# EAGLE design jayday_fez40_5v (EAGLE 6.3)
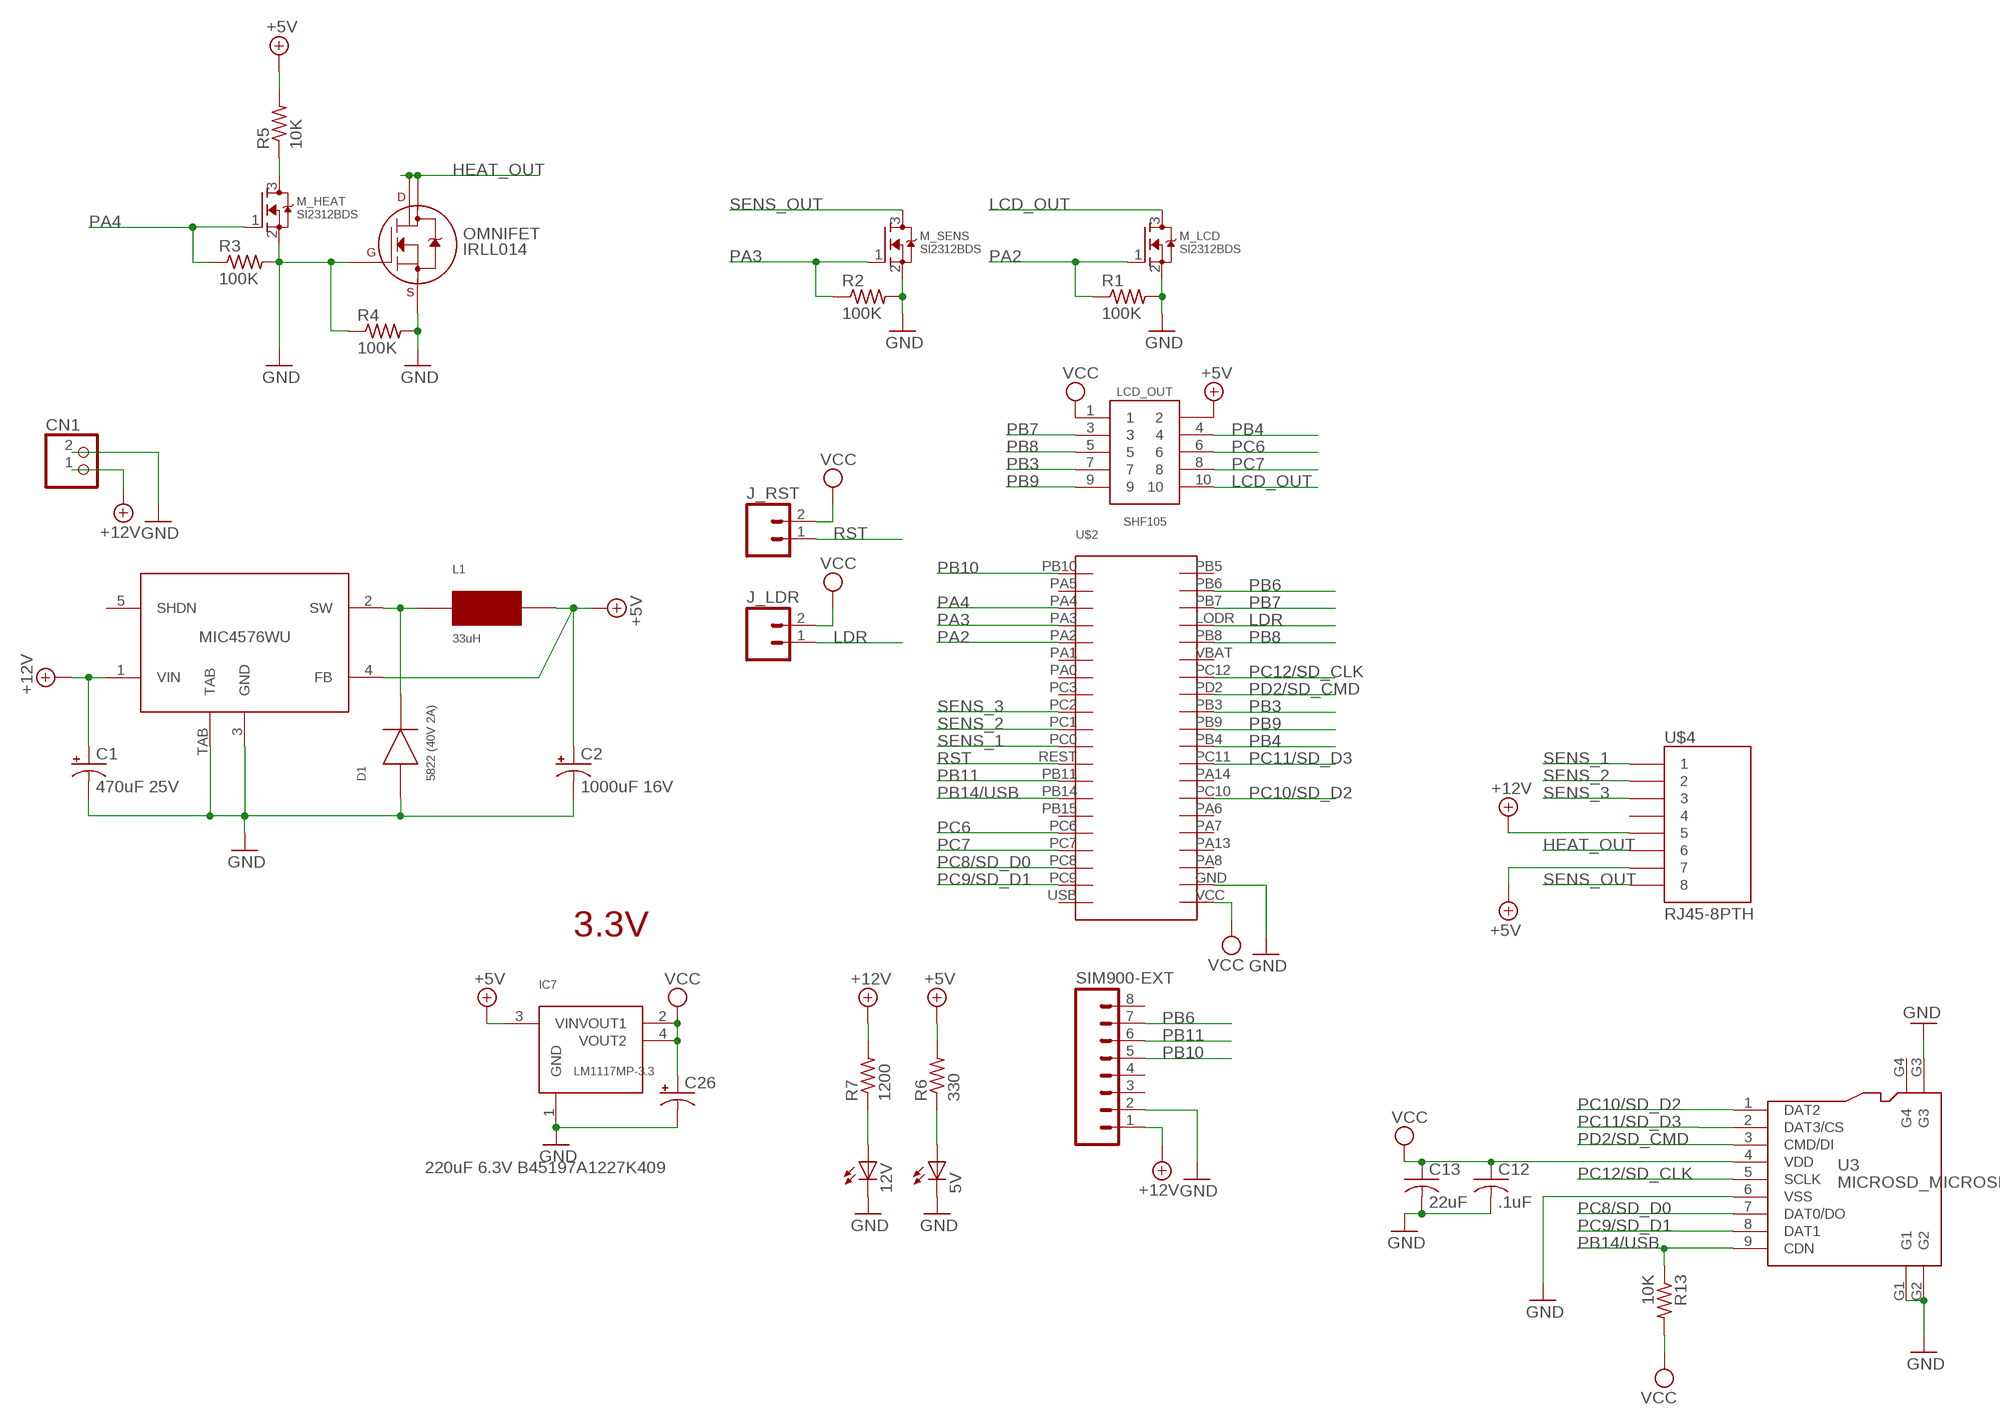
[diagram p0: schematic, sheet 1]

## Parts
5V  LEDCHIPLED_0805  [CHIPLED_0805]
12V  LEDCHIPLED_0805  [CHIPLED_0805]
C1  470uF 25V  CAP_POLE  [PANASONIC_E]
C2  1000uF 16V  CAP_POLE  [PANASONIC_E]
C12  .1uF  C-USC0603K  [C0603K]
C13  22uF  C-USC0805K  [C0805K]
C26  220uF 6.3V B45197A1227K409  CPOL-USD/7343-31W  [D/7343-31W]
CN1  JST_2PIN-THM-RA  [JST-PH-2-THM-RA]
D1  5822 (40V 2A)  GHI_DIODE_SMA  [GHI_DIODE_SMA]
IC7  LM1117MP-3.3  LM1117  [SOT223]
J_LDR  M02PTH  [1X02]
J_RST  M02PTH  [1X02]
L1  33uH  GHI_UP2BXXX  [GHI_UP2BXXX]
LCD_OUT  SHF105  [GAD_PAC_SMD]
M_HEAT  SI2312BDS  [TO-236]
M_LCD  SI2312BDS  [TO-236]
M_SENS  SI2312BDS  [TO-236]
OMNIFET  IRLL014  [SOT-223]
R1  100K  R-US_R0603  [R0603]
R2  100K  R-US_R0603  [R0603]
R3  100K  R-US_R0603  [R0603]
R4  100K  R-US_R0603  [R0603]
R5  10K  R-US_R0603  [R0603]
R6  330  R-US_R0603  [R0603]
R7  1200  R-US_R0603  [R0603]
R13  10K  R-US_R0603  [R0603]
SIM900-EXT  M081X08  [1X08]
U3  MICROSD_MICROSD  [MICROSD_MICROSD]
U$1  MIC4576WU  [TO263-5]
U$2  FEZ_CERB_40  [FEZ_CERB_40]
U$4  RJ45-8PTH  [RJ45-8]

## Nets
+5V [power]: C2.+ IC7.3(VIN) L1.P$2 LCD_OUT.2 R5.2 R6.2 U$1.4(FB) U$4.7
+12V [power]: C1.+ CN1.1 R7.2 SIM900-EXT.1 U$1.1(VIN) U$4.5
GND [power]: 5V.C 12V.C C1.- C2.- C12.2 C13.2 C26.- CN1.2 D1.A IC7.1(GND) M_HEAT.2(S) M_LCD.2(S) M_SENS.2(S) OMNIFET.1(G) OMNIFET.3(S) R1.2 R2.2 R3.2 R4.1 R4.2 SIM900-EXT.2 U3.6(VSS) U3.G1 U3.G2 U3.G3 U$1.3(GND) U$1.TAB U$2.GND
HEAT_OUT: OMNIFET.2(D1) OMNIFET.4(D2) U$4.6
LCD_OUT: LCD_OUT.10 M_LCD.3(D)
LDR: J_LDR.1 U$2.LODR
N$1 [power]: D1.K L1.P$1 U$1.2(SW)
N$2: 5V.A R6.1
N$3: M_HEAT.3(D) R5.1
N$4: 12V.A R7.1
PA2: M_LCD.1(G) R1.1 U$2.PA2
PA3: M_SENS.1(G) R2.1 U$2.PA3
PA4: M_HEAT.1(G) R3.1 U$2.PA4
PB3: LCD_OUT.7 U$2.PB3
PB4: LCD_OUT.4 U$2.PB4
PB6: SIM900-EXT.7 U$2.PB6
PB7: LCD_OUT.3 U$2.PB7
PB8: LCD_OUT.5 U$2.PB8
PB9: LCD_OUT.9 U$2.PB9
PB10: SIM900-EXT.5 U$2.PB10
PB11: SIM900-EXT.6 U$2.PB11
PB14/USB: R13.1 U3.9(CDN) U$2.PB14
PC6: LCD_OUT.6 U$2.PC6
PC7: LCD_OUT.8 U$2.PC7
PC8/SD_D0: U3.7(DAT0/DO) U$2.PC8
PC9/SD_D1: U3.8(DAT1) U$2.PC9
PC10/SD_D2: U3.1(DAT2) U$2.PC10
PC11/SD_D3: U3.2(DAT3/CS) U$2.PC11
PC12/SD_CLK: U3.5(SCLK) U$2.PC12
PD2/SD_CMD: U3.3(CMD/DI) U$2.PD2
RST: J_RST.1 U$2.REST
SENS_1: U$2.PC0 U$4.1
SENS_2: U$2.PC1 U$4.2
SENS_3: U$2.PC2 U$4.3
SENS_OUT: M_SENS.3(D) U$4.8
VCC [lowpower]: C12.1 C13.1 C26.+ IC7.2(VOUT1) IC7.4(VOUT2) J_LDR.2 J_RST.2 LCD_OUT.1 R13.2 U3.4(VDD) U$2.VCC
Unconnected: SIM900-EXT.3 SIM900-EXT.4 SIM900-EXT.8 U3.G4 U$1.5(SHDN) U$2.PA0 U$2.PA1 U$2.PA5 U$2.PA6 U$2.PA7 U$2.PA8 U$2.PA13 U$2.PA14 U$2.PB5 U$2.PB15 U$2.PC3 U$2.USB U$2.VBAT U$4.4

## Notes on the sheet
- 3.3V

## Library data of the parts
5V 12V = led:LED: LED OSRAM: - CHIPLED LG R971, LG N971, LY N971, LG Q971, LY Q971, LO R971, LY R971 LH N974, LH R974 LS Q976, LO Q976, LY Q976 LO Q996 - Hyper CHIPLED LW Q18S LB Q993, LB Q99A, LB R99A - SideLED LS A670, LO A670, LY A670, LG A670, LP A670 LB A673, LV A673, LT A673, LW A673 LH A674 LY A675 LS A676, LA A676, LO A676, LY A676, LW A676 LS A679, LY A679, LG A679 - Hyper Micro SIDELED® LS Y876, LA Y876, LO Y876, LY Y876 LT Y87S - SmartLED LW L88C, LW L88S LB L89C, LB L89S, LG L890 LS L89K, LO L89K, LY L89K LS L896, LA L896, LO L896, LY L896 - TOPLED LS T670, LO T670, LY T670, LG T670, LP T670 LSG T670, LSP T670, LSY T670, LOP T670, LYG T670 LG T671, LOG T671, LSG T671 LB T673, LV T673, LT T673, LW T673 LH T674 LS T676, LA T676, LO T676, LY T676, LB T676, LH T676, LSB T676, LW T676 LB T67C, LV T67C, LT T67C, LS T67K, LO T67K, LY T67K, LW E67C LS E67B, LA E67B, LO E67B, LY E67B, LB E67C, LV E67C, LT E67C LW T67C LS T679, LY T679, LG T679 LS T770, LO T770, LY T770, LG T770, LP T770 LB T773, LV T773, LT T773, LW T773 LH T774 LS E675, LA E675, LY E675, LS T675 LS T776, LA T776, LO T776, LY T776, LB T776 LHGB T686 LT T68C, LB T68C - Hyper Mini TOPLED® LB M676 - Mini TOPLED Santana® LG M470 LS M47K, LO M47K, LY M47K Source: http://www.osram.convergy.de LUXEON: - LUMILED® LXK2-PW12-R00, LXK2-PW12-S00, LXK2-PW14-U00, LXK2-PW14-V00 LXK2-PM12-R00, LXK2-PM12-S00, LXK2-PM14-U00 LXK2-PE12-Q00, LXK2-PE12-R00, LXK2-PE12-S00, LXK2-PE14-T00, LXK2-PE14-U00 LXK2-PB12-K00, LXK2-PB12-L00, LXK2-PB12-M00, LXK2-PB14-N00, LXK2-PB14-P00, LXK2-PB14-Q00 LXK2-PR12-L00, LXK2-PR12-M00, LXK2-PR14-Q00, LXK2-PR14-R00 LXK2-PD12-Q00, LXK2-PD12-R00, LXK2-PD12-S00 LXK2-PH12-R00, LXK2-PH12-S00 LXK2-PL12-P00, LXK2-PL12-Q00, LXK2-PL12-R00 Source: www.luxeon.com KINGBRIGHT: KA-3528ASYC Source: www.kingbright.com
C1 C2 = SparkFun-Passives:CAP_POL: Capacitor Polarized These are standard SMD and PTH capacitors. Normally 10uF, 47uF, and 100uF in electrolytic and tantalum varieties. Always verify the external diameter of the through hole cap, it varies with capacity, voltage, and manufacturer. The EIA devices should be standard.
C12 C13 = rcl:C-US: CAPACITOR, American symbol
C26 = rcl:CPOL-US: POLARIZED CAPACITOR, American symbol
CN1 = adafruit:JST_2PIN: JST 2-Pin Connectors of various flavors SMT-RA (S2B-PH-SM4) 4UConnector #17311 SMT (B2B-PH-SM4) THM-RA (S2B-PH) THM (B2B-PH)
D1 = USB_Client_DP:GHI_DIODE_SMA
IC7 = GHI:LM1117
J_LDR J_RST = SparkFun-Connectors:M02: Header 2 Standard 2-pin 0.1" header. Use with straight break away headers (SKU : PRT-00116), right angle break away headers (PRT-00553), swiss pins (PRT-00743), machine pins (PRT-00117), and female headers (PRT-00115). Molex polarized connector foot print use with SKU : PRT-08233 with associated crimp pins and housings.
L1 = USB_Client_DP:GHI_UP2BXXX
LCD_OUT = ozlollc:SHF105
M_HEAT M_LCD M_SENS = ozlollc:SI2312BDS
OMNIFET = transistors:IRLL*: International Rectifier IRLL series N-channel enhancement mode MOSFET HEXFET Power MOSFET SOT-223 Includes body diode
R1-R5 = adafruit:R-US_: RESISTOR, American symbol
R6 R7 R13 = rcl:R-US_: RESISTOR, American symbol
SIM900-EXT = SparkFun-Connectors:M08: Header 8 Standard 8-pin 0.1" header. Use with straight break away headers (SKU : PRT-00116), right angle break away headers (PRT-00553), swiss pins (PRT-00743), machine pins (PRT-00117), and female headers (PRT-00115).
U3 = FEZ_Panda:MICROSD_MICROSD
U$1 = ozlollc:MIC4576WU
U$2 = ozlollc:FEZ_CERB_40: FEZ Cerb 40 GHI Electronics STM32F4 http://www.ghielectronics.com/catalog/product/353; VERSION: 1.1
U$4 = SparkFun-Connectors:RJ45-8: RJ45 Jack Simple RJ45, 8-pin connection - connector for common Cat5, Cat5e, and Cat6 Ethernet cables. Footprint not yet proven in production. Connector sku is PRT-00643; Breakout PCB sku is BOB-00716.

## Net classes
0 default: width 0.305 mm
1 power: width 0.813 mm
2 lowpower: width 0.61 mm

## Board
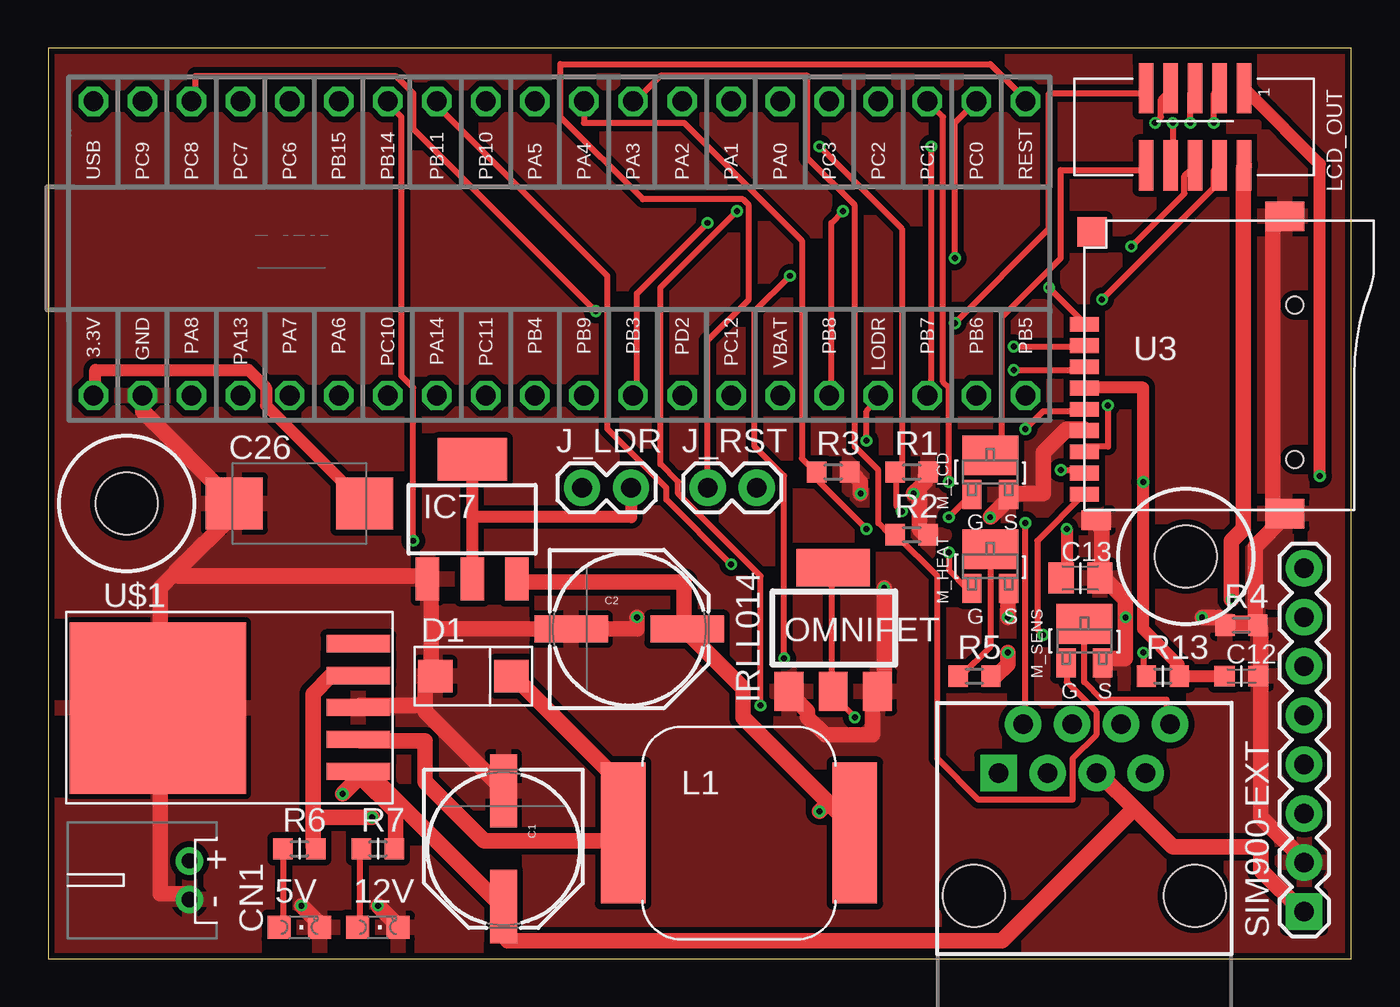
[diagram p1: board, top side]
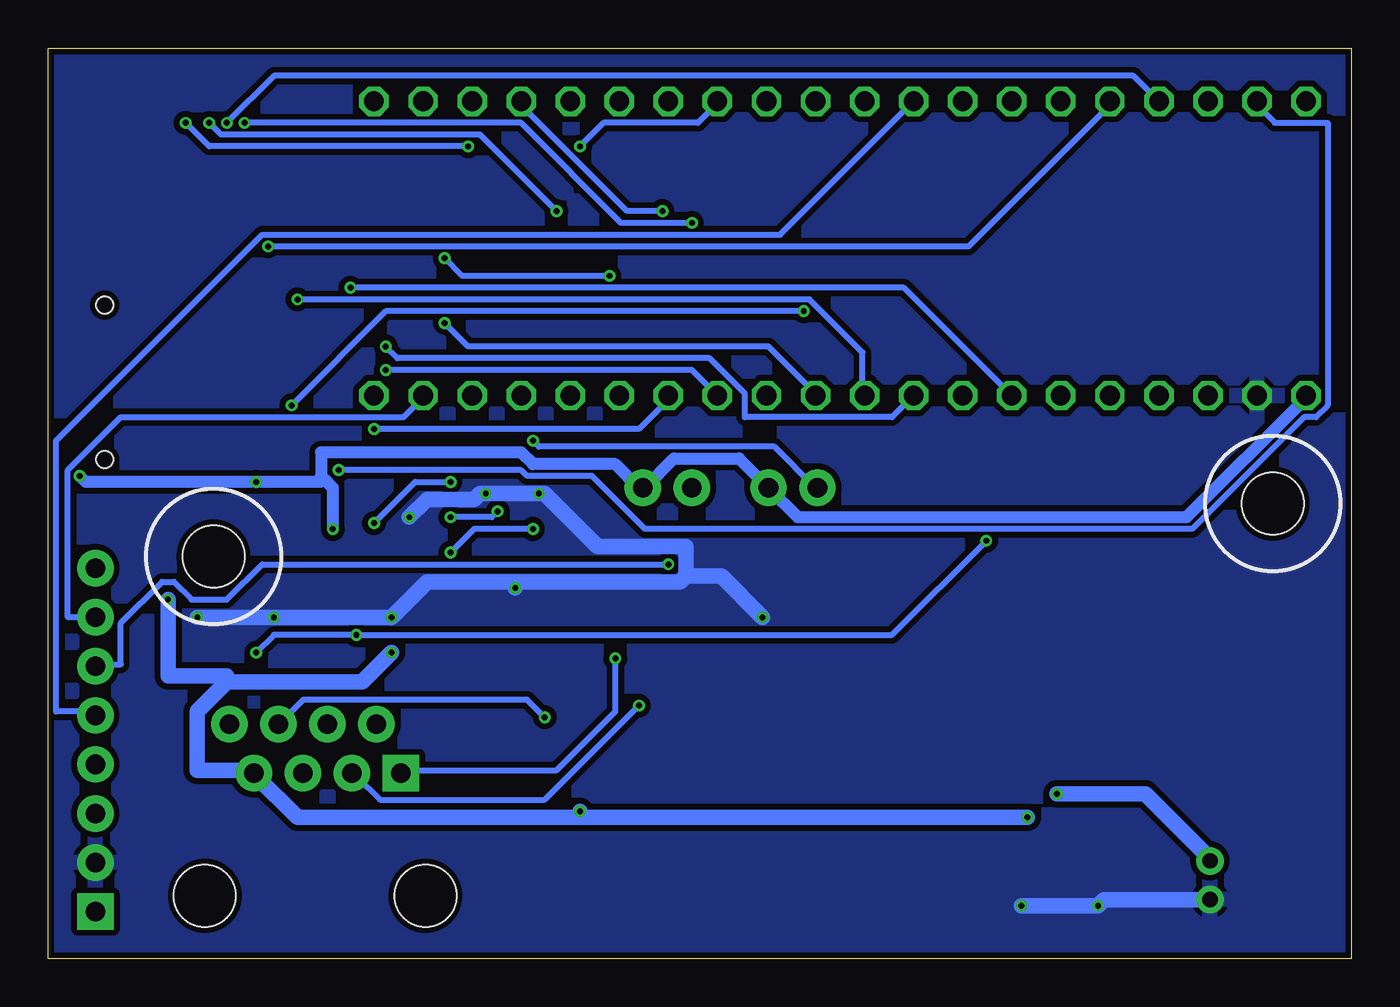
[diagram p2: board, bottom side, seen from below]

Size 67.46 x 47.14 mm. Coordinates in mm from the lower left corner, seen from the top.
Outline: 0,0 67.46,0 67.46,47.14 0,47.14 0,0
Copper layers (1*16): Top 0.035mm / dielectric 1.5mm / Bottom 0.035mm
Design rules "Fusion_eagle_rule_v1.1": minimum track width 6mil, minimum drill 12mil, track to track 6mil, track to pad 6mil, pad to pad 6mil, via to via 6mil, smd to smd 0mil, copper to edge 10mil, drill to drill 10mil, minimum pad ring 10mil, minimum via ring 6mil, stop-mask expansion 2mil, vias tented up to drill 100mil, thermal gap 10mil

### Footprints (pad centres in the part's own frame; a part is rotated, then mirrored left to right if it is on the bottom)
CHIPLED_0805 = smd 1.2 x 1.2: A 0,-1.05; C 0,1.05
PANASONIC_E = smd 3.8 x 1.4: + 3,0; - -3,0
C0603K = smd 1.05 x 1.08: 1 -0.875,0; 2 0.875,0
C0805K = smd 1.3 x 1.6: 1 -1,0; 2 1,0
D/7343-31W = smd 2.95 x 2.7: + 3.375,0; - -3.375,0
JST-PH-2-THM-RA = drill 0.8 pad 1.422: 1 1,0; 2 -1,0
GHI_DIODE_SMA = smd 1.778 x 1.676: A -1.905,0; K 2.032,0
SOT223 = smd 1.219 x 2.235: 1 -2.311,-3.099; 2 0,-3.099; 3 2.311,-3.099 | smd 3.6 x 2.2: 4 0,3.099
1X02 = drill 1.016 pad 1.88: 1 0,0; 2 2.54,0
GHI_UP2BXXX = smd 2.3 x 7.3: P$1 -6,0; P$2 6,0
GAD_PAC_SMD = smd 2.6 x 0.74: 1 -2,2.58; 2 2,2.58; 3 -2,1.31; 4 2,1.31; 5 -2,0.04; 6 2,0.04; 7 -2,-1.23; 8 2,-1.23; 9 -2,-2.5; 10 2,-2.5
TO-236 = smd 1 x 1.5: 1 -0.95,-1.15; 2 0.95,-1.15 | smd 2.9 x 2.05: 3 0,0.875
SOT-223 = smd 1.499 x 2.007: 1 -2.3,-3.235; 2 0,-3.235; 3 2.3,-3.235 | smd 3.81 x 1.93: 4 0,3.175
R0603 = smd 1 x 1.1: 1 -0.85,0; 2 0.85,0
1X08 = drill 1.016 pad 1.88 square: 1 0,0 | drill 1.016 pad 1.88: 2 2.54,0; 3 5.08,0; 4 7.62,0; 5 10.16,0; 6 12.7,0; 7 15.24,0; 8 17.78,0
MICROSD_MICROSD = smd 1.524 x 0.762: 1 0,4.4; 2 0,3.3; 3 0,2.2; 4 0,1.1; 5 0,0; 6 0,-1.1; 7 0,-2.2; 8 0,-3.3; 9 0,-4.4 | smd 1.524 x 1.016: G1 0.6,-5.746 | smd 2.032 x 1.524: G2 10.373,-5.4; G3 10.373,10 | smd 1.524 x 1.524: G4 0.392,9.181 | hole 0.889: 10.9,-2.6; 10.9,5.4
TO263-5 = smd 3.302 x 0.889: 1 7.112,-3.302; 2 7.112,-1.651; 3 7.112,0; 4 7.112,1.651; 5 7.112,3.302 | smd 9.12 x 8.89: TAB -3.261,-0.03
FEZ_CERB_40 = drill 1.016 pad 1.524 octagon: GND 4.064,1.524; LODR 42.164,1.524; PA0 37.084,16.764; PA1 34.544,16.764; PA2 32.004,16.764; PA3 29.464,16.764; PA4 26.924,16.764; PA5 24.384,16.764; PA6 14.224,1.524; PA7 11.684,1.524; PA8 6.604,1.524; PA13 9.144,1.524; PA14 19.304,1.524; PB3 29.464,1.524; PB4 24.384,1.524; PB5 49.784,1.524; PB6 47.244,1.524; PB7 44.704,1.524; PB8 39.624,1.524; PB9 26.924,1.524; PB10 21.844,16.764; PB11 19.304,16.764; PB14 16.764,16.764; PB15 14.224,16.764; PC0 47.244,16.764; PC1 44.704,16.764; PC2 42.164,16.764; PC3 39.624,16.764; PC6 11.684,16.764; PC7 9.144,16.764; PC8 6.604,16.764; PC9 4.064,16.764; PC10 16.764,1.524; PC11 21.844,1.524; PC12 34.544,1.524; PD2 32.004,1.524; REST 49.784,16.764; USB 1.524,16.764; VBAT 37.084,1.524; VCC 1.524,1.524
HOLE3.2 = hole 3.2: 0,0
RJ45-8 = drill 1 pad 1.88 square: 1 -4.445,6.35 | drill 1 pad 1.88: 2 -3.175,8.89; 3 -1.905,6.35; 4 -0.635,8.89; 5 0.635,6.35; 6 1.905,8.89; 7 3.175,6.35; 8 4.445,8.89 | hole 3.2: -5.715,0; 5.715,0

### Placement (x,y rotation side)
5V  13,1.63 270 top
12V  17.07,1.63 270 top
C1  23.57,5.69 270 top
C2  30.07,17.07 0 top
C12  61.77,14.63 0 top
C13  53.44,19.71 0 top
C26  13,23.57 0 top
CN1  7.32,4.06 90 top
D1  21.95,14.63 0 top
IC7  21.95,22.76 0 top
J_LDR  27.64,24.38 0 top
J_RST  34.14,24.38 0 top
L1  35.76,6.5 0 top
LCD_OUT  59.33,43.08 270 top
M_HEAT  48.77,20.32 0 top
M_LCD  48.77,25.2 0 top
M_SENS  53.64,16.46 0 top
OMNIFET  40.64,17.07 0 top
R1  44.7,25.2 0 top
R2  44.7,21.95 0 top
R3  40.64,25.2 0 top
R4  61.77,17.27 0 top
R5  47.96,14.63 0 top
R6  13,5.69 0 top
R7  17.07,5.69 0 top
R13  57.71,14.63 0 top
SIM900-EXT  65.02,2.44 90 top
U3  53.64,28.45 0 top
U$1  8.94,13 0 top
U$2  0.81,27.64 0 top
U$3  [HOLE3.2]  58.9,20.83 0 top
U$4  53.64,3.25 0 top
U$8  [HOLE3.2]  4.06,23.57 0 top

### Tracks (layer width: path | path; a pad name or v marks a point on that pad's centre or on a via)
+5V  (via drill 0.3)
  Top 0.813: IC7.3 24.38,19.51 32.92,19.51 32.92,17.07 C2.+ 33.22,16.76 35.97,14.02 35.97,12.5 40.39,8.08 | 40.39,8.08 41.76,6.71 L1.P$2 | 13.72,7.32 13.72,13.72 14.63,14.63 15.85,14.63 U$1.4 | 13.72,7.32 13.72,5.79 R6.2 | v49.68,15.85 49.68,15.24 49.07,14.63 R5.2 | v61.27,18.59 61.27,21.64 61.87,22.25 61.87,40.84 LCD_OUT.2 | v16.76,7.32 13.72,7.32 | v39.93,7.62 40.39,8.08
  Bottom 0.813: v49.68,15.85 51.21,14.33 58.22,14.33 | 58.22,14.33 59.74,12.8 59.74,9.75 57,9.75 U$4.7 56.69,9.45 54.56,7.32 39.93,7.32 | v61.27,18.59 61.27,14.63 58.22,14.63 58.22,14.33 | 39.93,7.32 v16.76,7.32 | v39.93,7.62 39.93,7.32
+12V  (via drill 0.3)
  Top 0.813: 56.24,7.77 58.22,5.79 62.79,5.79 62.79,4.57 64.92,2.44 SIM900-EXT.1 | 56.24,7.77 54.56,9.45 U$4.5 | 16.15,9.45 17.98,7.62 17.98,5.79 R7.2 | 16.15,9.45 U$1.1 16.46,9.75 23.47,2.74 C1.+ 23.77,2.44 23.77,0.91 49.38,0.91 56.24,7.77 | 16.15,9.45 v15.24,8.53
  Bottom 0.813: v15.24,8.53 10.67,8.53 7.32,5.18 CN1.1
GND  (via drill 0.3)
  Top 0.813: 19.81,17.07 19.81,19.51 IC7.1 19.51,19.81 6.71,19.81 6.55,19.96 | 19.81,17.07 19.81,14.63 D1.A 19.51,14.63 19.51,13.11 | 19.51,13.11 16.15,13.11 U$1.3 | C1.- 23.47,8.84 19.51,12.8 19.51,13.11 | 19.81,17.07 C2.- 30.48,17.07 v30.48,17.68 | U$2.GND 4.88,28.35 9.45,23.77 C26.- 9.75,23.16 6.55,19.96 | v13.11,2.74 14.02,1.83 5V.C | v17.07,2.74 17.98,1.83 12V.C | CN1.2 7.32,3.35 5.79,3.35 5.79,12.8 U$1.TAB 5.79,13.11 5.79,19.2 6.55,19.96 | M_SENS.2 54.86,15.54 55.78,15.54 v55.78,17.68 55.78,18.59 54.56,19.81 C13.2 54.56,20.12 54.56,22.25 54.25,22.55 U3.G1 | OMNIFET.1 38.41,13.72 39.32,12.8 39.32,12.5 40.23,11.58 42.67,11.58 42.67,13.72 OMNIFET.3 43.28,14.02 v43.28,19.2 | U3.6 53.65,27.43 52.73,27.43 51.51,26.21 51.51,24.08 49.99,24.08 M_LCD.2 49.68,23.77 v48.77,22.86 | v42.06,24.08 42.06,24.69 41.76,24.99 R3.2 | 44.96,24.23 45.41,24.69 45.41,24.99 R1.2 | 44.96,24.23 v44.81,24.08 | R2.2 45.41,21.95 45.11,22.25 45.11,24.08 44.96,24.23 | v49.68,17.68 49.68,18.9 M_HEAT.2 | R4.2 62.79,17.07 62.79,14.63 C12.2 62.79,14.33 62.79,7.32 64.92,5.18 SIM900-EXT.2 | R4.2 62.48,17.37 60.96,17.37 R4.1 60.66,17.68 v59.74,17.68 | R4.2 62.48,17.68 62.48,21.34 64.01,22.86 U3.G2 63.4,22.55 63.4,37.8 64.01,38.41 U3.G3
  Bottom 0.813: CN1.2 7.32,3.05 12.8,3.05 v13.11,2.74 v17.07,2.74 | 43.28,19.51 34.75,19.51 34.44,19.81 | 43.28,19.51 47.85,19.51 v49.68,17.68 v55.78,17.68 v59.74,17.68 | 34.44,19.81 34.44,21.34 39.01,21.34 41.76,24.08 v42.06,24.08 v44.81,24.08 45.11,24.08 45.41,23.77 47.85,23.77 v48.77,22.86 | v43.28,19.2 43.28,19.51 | v30.48,17.68 32.61,19.81 34.44,19.81
  pour Bottom (isolate 0.305): 0,47.14 67.46,47.14 67.46,0 0,0
  pour Top (isolate 0.305): 0,47.14 67.46,47.14 67.46,0 0,0
HEAT_OUT  (via drill 0.3)
  Top 0.305: OMNIFET.4 40.54,20.12 40.54,14.02 OMNIFET.2 40.84,13.72 40.84,13.41 v41.76,12.5
  Bottom 0.305: v41.76,12.5 42.67,13.41 54.25,13.41 55.47,12.19 U$4.6
LCD_OUT
  Top 0.305: LCD_OUT.10 56.69,40.84 52.43,40.84 52.43,36.27 49.38,33.22 49.38,26.82 48.77,26.21 M_LCD.3
LDR  (via drill 0.3)
  Top 0.305: v42.37,26.82 42.37,28.35 42.98,28.96 U$2.LODR
  Bottom 0.305: v42.37,26.82 42.06,26.52 29.87,26.52 27.74,24.38 J_LDR.1
N$1
  Top 0.813: D1.K 24.08,14.63 29.57,9.14 29.57,6.71 L1.P$1 29.26,6.71 29.26,6.1 22.55,6.1 19.51,9.14 19.51,11.28 16.15,11.28 U$1.2
N$2
  Top 0.305: R6.1 12.19,5.49 12.19,1.83 5V.A
N$3
  Top 0.305: M_HEAT.3 48.77,16.15 47.24,14.63 R5.1
N$4
  Top 0.305: R7.1 16.15,5.49 16.15,1.83 12V.A
PA2  (via drill 0.3)
  Top 0.305: v39.93,42.06 44.2,37.8 44.2,25.6 43.89,25.3 R1.1 43.89,24.99 43.89,23.47 v44.2,23.16 | v46.63,22.86 47.55,23.77 M_LCD.1
  Bottom 0.305: v39.93,42.06 38.71,43.28 33.83,43.28 32.92,44.2 U$2.PA2 | v46.63,22.86 44.5,22.86 v44.2,23.16
PA3
  Top 0.305: M_SENS.1 52.73,15.24 52.73,14.33 54.25,12.8 54.25,11.58 53.03,10.36 53.03,8.23 48.16,8.23 46.02,10.36 46.02,19.81 43.89,21.95 R2.1 43.59,21.95 42.98,22.55 42.98,25.3 41.76,26.52 41.76,39.01 39.32,41.45 39.32,45.72 31.7,45.72 30.48,44.5 U$2.PA3
PA4  (via drill 0.3)
  Top 0.305: U$2.PA4 27.74,43.28 32.92,43.28 39.01,37.19 39.01,25.91 39.62,25.3 R3.1 39.93,24.99 39.93,24.69 v42.37,22.25 | v46.63,21.03 46.63,20.12 47.55,19.2 M_HEAT.1
  Bottom 0.305: v46.63,21.03 45.41,22.25 v42.37,22.25
PB3  (via drill 0.3)
  Top 0.305: v57.3,43.28 57.61,43.59 57.61,44.5 57.91,44.81 LCD_OUT.7 | v34.14,38.1 30.48,34.44 30.48,29.26 U$2.PB3
  Bottom 0.305: v57.3,43.28 42.98,43.28 37.8,38.1 v34.14,38.1
PB4  (via drill 0.3)
  Top 0.305: v54.56,34.14 60.35,39.93 60.35,40.84 LCD_OUT.4
  Bottom 0.305: v54.56,34.14 28.04,34.14 25.3,31.39 25.3,29.26 U$2.PB4
PB6
  Bottom 0.305: SIM900-EXT.7 66.45,17.68 66.45,25.3 63.7,28.04 49.07,28.04 48.16,28.96 U$2.PB6
PB7  (via drill 0.3)
  Top 0.305: v60.35,43.28 60.35,44.81 LCD_OUT.3 | v45.72,42.06 45.72,29.26 U$2.PB7
  Bottom 0.305: v60.35,43.28 59.13,42.06 v45.72,42.06
PB8  (via drill 0.3)
  Top 0.305: v59.13,43.28 59.13,44.81 LCD_OUT.5 | v41.15,38.71 40.54,38.1 40.54,29.26 U$2.PB8
  Bottom 0.305: v59.13,43.28 58.52,42.67 45.11,42.67 v41.15,38.71
PB9  (via drill 0.3)
  Top 0.305: v46.94,32.92 51.82,37.8 51.82,44.81 56.69,44.81 LCD_OUT.9
  Bottom 0.305: v46.94,32.92 45.72,31.7 30.18,31.7 27.74,29.26 U$2.PB9
PB10
  Bottom 0.305: U$2.PB10 29.57,37.49 56.39,37.49 67.06,26.82 67.06,12.8 65.23,12.8 SIM900-EXT.5
PB11  (via drill 0.3)
  Top 0.305: v35.36,20.42 32,23.77 32,24.38 28.96,27.43 28.96,35.36 20.12,44.2 U$2.PB11
  Bottom 0.305: v35.36,20.42 56.39,20.42 58.22,18.59 60.05,18.59 60.96,19.51 61.57,19.51 63.7,17.37 63.7,15.24 64.92,15.24 SIM900-EXT.6
PB14/USB  (via drill 0.3)
  Top 0.305: v56.69,15.85 56.69,14.63 R13.1 | v51.51,16.76 51.21,17.07 51.21,21.64 53.65,24.08 U3.9 | v18.9,21.64 18.9,29.57 18.29,30.18 18.29,43.59 17.68,44.2 U$2.PB14
  Bottom 0.305: v56.69,15.85 55.78,16.76 v51.51,16.76 23.77,16.76 v18.9,21.64
PC6  (via drill 0.3)
  Top 0.305: v56.08,36.88 58.83,39.62 58.83,40.54 59.13,40.84 LCD_OUT.6
  Bottom 0.305: v56.08,36.88 19.81,36.88 12.5,44.2 U$2.PC6
PC7  (via drill 0.3)
  Top 0.305: v58.22,43.28 58.22,41.15 LCD_OUT.8
  Bottom 0.305: v58.22,43.28 55.78,45.72 11.28,45.72 U$2.PC7
PC8/SD_D0  (via drill 0.3)
  Top 0.305: v54.86,28.65 54.86,26.52 53.65,26.52 U3.7 | v28.35,33.53 18.9,42.98 18.9,44.81 17.98,45.72 7.62,45.72 7.62,44.5 U$2.PC8
  Bottom 0.305: v54.86,28.65 49.99,33.53 v28.35,33.53
PC9/SD_D1  (via drill 0.3)
  Top 0.305: v52.43,25.3 53.65,25.3 U3.8
  Bottom 0.305: v52.43,25.3 42.98,25.3 42.67,24.99 39.32,24.99 36.58,22.25 8.23,22.25 2.44,28.04 1.83,28.04 1.22,28.65 1.22,43.28 3.96,43.28 4.88,44.2 U$2.PC9
PC10/SD_D2  (via drill 0.3)
  Top 0.305: v51.82,34.75 53.65,32.92 U3.1
  Bottom 0.305: v51.82,34.75 23.16,34.75 U$2.PC10
PC11/SD_D3  (via drill 0.3)
  Top 0.305: v49.99,31.7 53.65,31.7 U3.2
  Bottom 0.305: v49.99,31.7 49.38,31.09 33.22,31.09 31.39,29.26 31.39,28.04 23.77,28.04 U$2.PC11
PC12/SD_CLK  (via drill 0.3)
  Top 0.305: v50.6,27.43 51.51,28.35 53.65,28.35 U3.5
  Bottom 0.305: v50.6,27.43 36.88,27.43 35.36,28.96 U$2.PC12
PD2/SD_CMD  (via drill 0.3)
  Top 0.305: v49.99,30.48 53.65,30.48 U3.3
  Bottom 0.305: v49.99,30.48 34.14,30.48 U$2.PD2
RST
  Top 0.305: J_RST.1 34.14,32 36.27,34.14 36.27,39.01 35.97,39.32 30.79,39.32 26.52,43.59 26.52,46.33 48.77,46.33 50.6,44.5 U$2.REST
SENS_1  (via drill 0.3)
  Top 0.305: U$2.PC0 46.94,43.28 v46.94,36.27 | v38.41,35.36 36.58,33.53 36.58,26.52 38.1,24.99 v38.1,15.54
  Bottom 0.305: v46.94,36.27 46.02,35.36 v38.41,35.36 | v38.1,15.54 38.1,12.8 41.15,9.75 49.07,9.75 U$4.1
SENS_2  (via drill 0.3)
  Top 0.305: U$2.PC1 46.33,43.59 46.33,29.87 46.63,29.57 v46.63,24.69 | v50.6,22.55 50.6,12.19 U$4.2
  Bottom 0.305: v46.63,24.69 48.46,24.69 v50.6,22.55
SENS_3  (via drill 0.3)
  Top 0.305: v35.66,38.71 31.7,34.75 31.7,25.6 32.61,24.69 32.61,24.08 36.88,19.81 v36.88,13.11
  Bottom 0.305: v35.66,38.71 37.49,38.71 42.98,44.2 U$2.PC2 | v36.88,13.11 41.76,8.23 50.29,8.23 51.51,9.45 U$4.3
SENS_OUT
  Top 0.305: M_SENS.3 53.65,14.33 54.56,13.41 57.91,13.41 57.91,12.19 U$4.8
VCC  (via drill 0.3)
  Top 0.61: C26.+ 16.15,23.77 11.28,28.65 11.28,29.57 10.36,30.48 2.44,30.48 2.44,29.26 U$2.VCC | C12.1 R13.2 58.52,14.63 58.52,15.24 56.69,17.07 v56.69,24.69 56.69,29.57 53.65,29.57 U3.4 | IC7.4 21.95,22.86 | 21.95,22.86 IC7.2 | v52.73,22.25 52.73,19.81 C13.1 | v65.84,24.99 65.84,41.15 62.18,44.81 LCD_OUT.1 | 21.95,22.86 30.18,22.86 J_LDR.2
  Bottom 0.61: v52.73,22.25 52.73,24.38 53.19,24.84 | 53.19,24.84 53.34,24.99 53.34,26.21 42.98,26.21 42.37,25.6 38.1,25.6 36.88,24.38 J_RST.2 36.58,24.38 35.05,25.91 31.7,25.91 J_LDR.2 28.65,22.86 8.53,22.86 2.44,28.96 U$2.VCC | v65.84,24.99 65.53,24.69 v56.69,24.69 53.34,24.69 53.19,24.84